# Altium schematic sheet Capstone_Power.SchDoc
size A
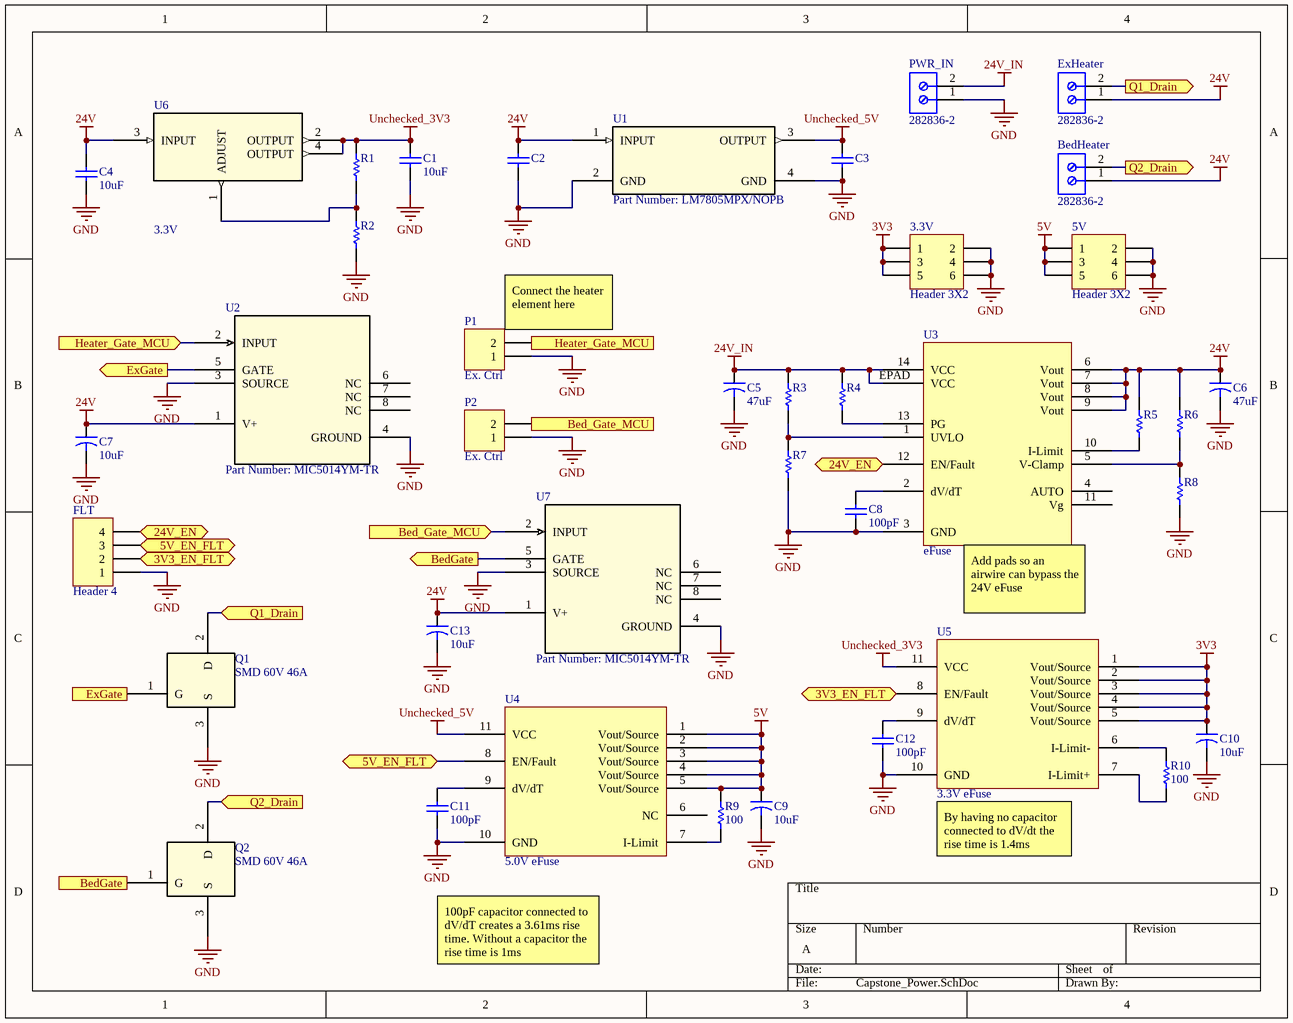
[diagram p0: Capstone_Power.SchDoc]

## Parts
3.3V  Header 3X2  [HDR2X3]
5V  Header 3X2  [HDR2X3]
BedHeater  282836-2  [TECO-282836-2_V]
C1  10uF  [RAD-0.3]
C2  Cap  [RAD-0.3]  (value not drawn)
C3  Cap  [RAD-0.3]  (value not drawn)
C4  10uF  [RAD-0.3]
C5  47uF  [CAPR5-4X5]
C6  47uF  [CAPR5-4X5]
C7  10uF  [CAPR5-4X5]
C8  100pF  [RAD-0.3]
C9  10uF  [CAPR5-4X5]
C10  10uF  [CAPR5-4X5]
C11  100pF  [RAD-0.3]
C12  100pF  [RAD-0.3]
C13  10uF  [CAPR5-4X5]
ExHeater  282836-2  [TECO-282836-2_V]
FLT  Header 4  [HDR1X4]
P1  Ex. Ctrl  [HDR1X2]
P2  Ex. Ctrl  [HDR1X2]
PWR_IN  282836-2  [TECO-282836-2_V]
Q1  SMD 60V 46A  [SC_TO-252AA]
Q2  SMD 60V 46A  [SC_TO-252AA]
R1  Res1  [AXIAL-0.3]  (value not drawn)
R2  Res1  [AXIAL-0.3]  (value not drawn)
R3  (no value)  [AXIAL-0.3]
R4  (no value)  [AXIAL-0.3]
R5  (no value)  [AXIAL-0.3]
R6  (no value)  [AXIAL-0.3]
R7  (no value)  [AXIAL-0.3]
R8  (no value)  [AXIAL-0.3]
R9  100  [AXIAL-0.3]
R10  100  [AXIAL-0.3]
U1  Part Number: LM7805MPX/NOPB  [DCY4]
U2  Part Number: MIC5014YM-TR  [SOIC-8_M]
U3  eFuse  [PWP14]
U4  5.0V eFuse  [*DFN-10_DD]
U5  3.3V eFuse  [*DFN-10_DD]
U6  3.3V  [DCY4]
U7  Part Number: MIC5014YM-TR  [SOIC-8_M]

## Ports
3V3_EN_FLT (bidir), 5V_EN_FLT (bidir), 24V_EN (bidir), Bed_Gate_MCU (in), Bed_Gate_MCU (out), BedGate (in), BedGate (out), ExGate (in), ExGate (out), Heater_Gate_MCU (in), Heater_Gate_MCU (out), Q1_Drain (in), Q1_Drain (out), Q2_Drain (in), Q2_Drain (out)

## Nets
3V3: 3.3V.1 3.3V.3 3.3V.5 C10.1 U5.1(Vout/Source) U5.2(Vout/Source) U5.3(Vout/Source) U5.4(Vout/Source) U5.5(Vout/Source)
5V: 5V.1 5V.3 5V.5 C9.1 R9.2 U4.1(Vout/Source) U4.2(Vout/Source) U4.3(Vout/Source) U4.4(Vout/Source) U4.5(Vout/Source)
24V: BedHeater.1 C2.2 C4.2 C6.1 C7.1 C13.1 ExHeater.1 R5.2 R6.2 U1.1(INPUT) U2.1(V+) U3.6(Vout) U3.7(Vout) U3.8(Vout) U3.9(Vout) U6.3(INPUT) U7.1(V+)
24V_IN: C5.1 PWR_IN.2 R3.2 R4.2 U3.14(VCC) U3.EPAD(VCC)
GND: 3.3V.2 3.3V.4 3.3V.6 5V.2 5V.4 5V.6 C1.1 C2.1 C3.1 C4.1 C5.2 C6.2 C7.2 C8.1 C9.2 C10.2 C11.1 C12.1 C13.2 FLT.1 P1.1 P2.1 PWR_IN.1 Q1.3(S) Q2.3(S) R2.1 R7.1 R8.1 U1.2(GND) U1.4(GND) U2.3(SOURCE) U2.4(GROUND) U3.3(GND) U4.10(GND) U5.10(GND) U7.3(SOURCE) U7.4(GROUND)
Unchecked_3V3: C1.2 R1.2 U5.11(VCC) U6.2(OUTPUT) U6.4(OUTPUT)
Unchecked_5V: C3.2 U1.3(OUTPUT) U4.11(VCC)
3V3_EN_FLT: FLT.2 U5.8(EN/Fault) ; port 3V3_EN_FLT
5V_EN_FLT: FLT.3 U4.8(EN/Fault) ; port 5V_EN_FLT
24V_EN: FLT.4 U3.12(EN/Fault) ; port 24V_EN
Bed_Gate_MCU: P2.2 U7.2(INPUT) ; port Bed_Gate_MCU
BedGate: Q2.1(G) U7.5(GATE) ; port BedGate
ExGate: Q1.1(G) U2.5(GATE) ; port ExGate
Heater_Gate_MCU: P1.2 U2.2(INPUT) ; port Heater_Gate_MCU
Q1_Drain: ExHeater.2 Q1.2(D) ; port Q1_Drain
Q2_Drain: BedHeater.2 Q2.2(D) ; port Q2_Drain
NetC8_2: C8.2 U3.2(dV/dT)
NetC11_2: C11.2 U4.9(dV/dT)
NetC12_2: C12.2 U5.9(dV/dT)
NetR1_1: R1.1 R2.2 U6.1(ADJUST)
NetR3_1: R3.1 R7.2 U3.1(UVLO)
NetR4_1: R4.1 U3.13(PG)
NetR5_1: R5.1 U3.10(I-Limit)
NetR6_1: R6.1 R8.2 U3.5(V-Clamp)
NetR9_1: R9.1 U4.7(I-Limit)
NetR10_1: R10.1 U5.7(I-Limit+)
NetR10_2: R10.2 U5.6(I-Limit-)

Not connected (* = marked no-connect by the designer): U2 6(NC) 7(NC) 8(NC); U3 4(AUTO) 11(Vg); U4 6(NC); U7 6(NC) 7(NC) 8(NC)

## Notes on the sheet
- (near P1) Connect the heater element here
- (near U3) Add pads so an airwire can bypass the 24V eFuse
- (near U5) By having no capacitor connected to dV/dt the rise time is 1.4ms
- 100pF capacitor connected to dV/dT creates a 3.61ms rise time. Without a capacitor the rise time is 1ms

## Library data of the parts
3.3V 5V = Header 3X2: Header, 3-Pin, Dual row; LatestRevisionDate: 17-Jul-2002; LatestRevisionNote: Re-released for DXP Platform.; Publisher: Altium Limited
BedHeater ExHeater PWR_IN = CMP-1684-00017-1: Female Header, Pitch 5 mm, 1 x 2 Position, Height 10 mm, Tail Length 3.5 mm, Rohs, Bulk; Manufacturer: TE Connectivity; Wire Gauge: 16-30AWG; Product Training Modules: Wire-to-BoardEurostyleTerminalBlocks; Clamp Material - Plating: Brass-NickelPlated; Voltage: 300V; Mating Orientation: HorizontalwithBoard; Current: 13.5A; Pitch: 0.197"(5.00mm); Screw Thread: M3; 3D Model: 282836-2.pdf; Other Names: 5ULV-02B / A98076; Dynamic Catalog: BuchananSeries; Number of Levels: 1; Torque - Screw: 0.68Nm(6Lb-In); Featured Product: EurostyleTerminalBlockConnectors; Positions Per Level: 2; Wire Termination: Screw-RisingCageClamp; Datasheet URL: http://www.te.com.cn/commerce/DocumentDelivery/DDEController?Action=showdoc&DocId=Catalog+Section%7F1308389_EUROSTYLE_TERMINAL_BLOCKS%7F0607%7Fpdf%7FEnglish%7FENG_CS_1308389_EUROSTYLE_TERMINAL_BLOCKS_0607.pdf%7F282836-2; Color: Green; Family: TerminalBlocks-WiretoBoard; RoHS Information: 282836-2StatementofCompliance; Standard Package: 300; Contact Material - Plating: Brass-TinPlated; Manufacturer URL: http://www.te.com; Housing Material: Polyamide(PA66),Nylon6/6; Features: Interlocking(Side); Package Description: Female Header, Pitch 5 mm, 1 x 2 Position, Height 10 mm, Tail Length 3.5 mm; Mounting Type: ThroughHole; Package Reference: THD; Packaging: Bulk; Series: Buchanan; Category: Connectors,Interconnects; Screw Material - Plating: Brass-NickelPlated
C1-C4 = Cap: Capacitor; Value: 100pF; Published: 8-Jun-2000; LatestRevisionDate: 17-Jul-2002; LatestRevisionNote: Re-released for DXP Platform.; PackageReference: RAD-0.3; Publisher: Altium Limited; PackageDescription: Radial Cap, Thru-Hole; 2 Leads; 0.3 in Pin Spacing
C5-C7 C9 C10 C13 = Cap2: Capacitor; Value: 100pF; Published: 23-Sep-2002; PackageReference: CAPR5-4X5; Publisher: Altium Limited; PackageDescription: Capacitor; 2 Leads
C8 C11 C12 = Cap: Capacitor; Published: 8-Jun-2000; LatestRevisionDate: 17-Jul-2002; LatestRevisionNote: Re-released for DXP Platform.; PackageReference: RAD-0.3; Publisher: Altium Limited; PackageDescription: Radial Cap, Thru-Hole; 2 Leads; 0.3 in Pin Spacing; Value: 100pF
FLT = Header 4: Header, 4-Pin; LatestRevisionDate: 17-Jul-2002; LatestRevisionNote: Re-released for DXP Platform.; Publisher: Altium Limited
P1 P2 = Header 2: Header, 2-Pin; LatestRevisionDate: 17-Jul-2002; LatestRevisionNote: Re-released for DXP Platform.; Publisher: Altium Limited
Q1 Q2 = NTD5865NLT4G: N-Channel 60V 46A (Tc) 71W (Tc) Surface Mount DPAK; ComponentLink1Description: Digikey; ComponentLink1URL: https://www.digikey.com/product-detail/en/on-semiconductor/NTD5865NLT4G/NTD5865NLT4GOSCT-ND/2409629
R1-R10 = Res1: Resistor; Value: 1K; Published: 8-Jun-2000; LatestRevisionDate: 17-Jul-2002; LatestRevisionNote: Re-released for DXP Platform.; PackageReference: AXIAL-0.3; Publisher: Altium Limited; PackageDescription: Axial Device, Thru-Hole; 2 Leads; 0.3 in Pin Spacing
U1 = LM7805MPX/NOPB: No Description Available; Vendor: Texas Instruments; Built_By: EMA_Jessica; Manufacturer_Part_Number: LM7805MPX/NOPB; Copyright: Copyright (C) 2018 Accelerated Designs. All rights reserved; RefDes: RefDes; Type: DEV; Value: Value
U2 U7 = MIC5014YM-TR: No Description Available; Built_By: EMA_Jessica; Vendor: Microchip; Copyright: Copyright (C) 2018 Accelerated Designs. All rights reserved; Manufacturer_Part_Number: MIC5014YM-TR; RefDes: RefDes; Type: DEV; Value: Value
U3 = STEF01: 8V-48V 4A eFuse
U4 = STEF05: The STEF05D is an integrated electronic fuse / optimized for monitoring output current and input / voltage. Connected in series to a 5 V rail, it is / capable of protecting the electronic circuitry on its / output from overcurrent and overvoltage. The / device has a controlled delay and turn-on time. / When an overload condition occurs, the / STEF05D limits the output current to a predefined / safe value. If the anomalous overload condition. / persists, it goes into an open state, disconnecting / the load from the power supply. If a continuous / short-circuit is present on the board, when power / is re-applied the E-fuse initially limits the output / current to a safe value, and then again goes into / an open state.
U5 = STEF033
U6 = LM317DCYR: Part Number: LM317DCYR; Vendor: Texas Instruments; Built_By: EMA_UL_Team; Manufacturer_Part_Number: LM317DCYR; Copyright: Copyright (C) 2018 Accelerated Designs. All rights reserved; RefDes: RefDes; Type: DEV; Value: Value; ComponentLink1Description: Digikey; ComponentLink1URL: https://www.digikey.com/product-detail/en/texas-instruments/LM317DCYR/296-12602-1-ND/443738; ComponentLink2Description: Datasheet; ComponentLink2URL: http://www.ti.com/lit/ds/symlink/lm317.pdf